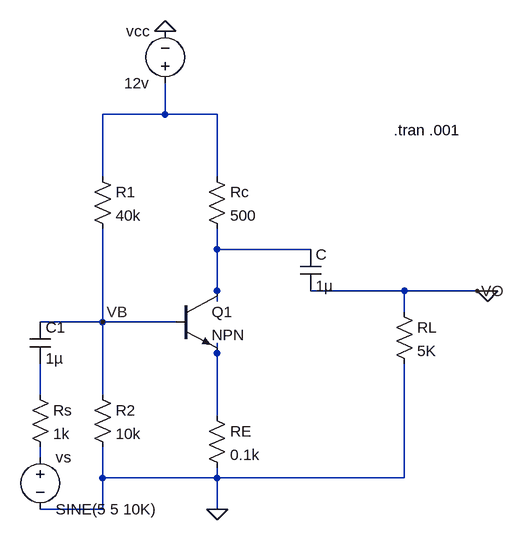
[diagram p0: schematic electronics1.asc]
electronics1.asc, the LTspice schematic file:
Version 4
SHEET 1 928 788
WIRE 400 160 400 112
WIRE 400 160 304 160
WIRE 480 160 400 160
WIRE 304 256 304 160
WIRE 480 256 480 160
WIRE 480 368 480 336
WIRE 624 368 480 368
WIRE 480 432 480 368
WIRE 768 432 624 432
WIRE 880 432 768 432
WIRE 480 448 480 432
WIRE 768 464 768 432
WIRE 304 480 304 336
WIRE 304 480 208 480
WIRE 416 480 304 480
WIRE 480 528 480 512
WIRE 208 592 208 544
WIRE 304 592 304 480
WIRE 480 624 480 528
WIRE 208 688 208 672
WIRE 304 720 304 672
WIRE 480 720 480 704
WIRE 480 720 304 720
WIRE 768 720 768 544
WIRE 768 720 480 720
WIRE 304 768 304 720
WIRE 304 768 208 768
WIRE 480 768 480 720
FLAG 304 480 VB
FLAG 880 432 VO
FLAG 480 768 0
FLAG 400 32 0
FLAG 896 432 0
SYMBOL /res 288 240 R0
SYMATTR InstName R1
SYMATTR Value 40k
SYMBOL /res 464 240 R0
SYMATTR InstName Rc
SYMATTR Value 500
SYMBOL /cap 608 368 R0
SYMATTR InstName C
SYMATTR Value 1µ
SYMBOL /res 752 448 R0
SYMATTR InstName RL
SYMATTR Value 5K
SYMBOL /res 464 608 R0
SYMATTR InstName RE
SYMATTR Value 0.1k
SYMBOL /npn 416 432 R0
SYMATTR InstName Q1
SYMBOL /res 288 576 R0
SYMATTR InstName R2
SYMATTR Value 10k
SYMBOL /cap 192 480 R0
SYMATTR InstName C1
SYMATTR Value 1µ
SYMBOL /res 192 576 R0
SYMATTR InstName Rs
SYMATTR Value 1k
SYMBOL /voltage 208 672 R0
WINDOW 123 0 0 Left 0
WINDOW 39 0 0 Left 0
SYMATTR InstName vs
SYMATTR Value SINE(5 5 10K)
SYMBOL /voltage 400 128 R180
WINDOW 0 24 96 Left 2
WINDOW 3 24 16 Left 2
WINDOW 123 0 0 Left 0
WINDOW 39 0 0 Left 0
SYMATTR InstName vcc
SYMATTR Value 12v
TEXT 752 184 Left 2 !.tran .001

The netlist it stands for:
* electronics1.asc
R1 N001 VB 40k
Rc N001 N002 500
C N002 VO 1µ
RL VO 0 5K
RE N003 0 0.1k
Q1 N002 VB N003 0 NPN
R2 VB 0 10k
C1 VB N004 1µ
Rs N004 N005 1k
vs N005 0 SINE(5 5 10K)
vcc N001 0 12v
.model NPN NPN
.model PNP PNP
.lib standard.bjt
.tran .001
.backanno
.end